# Altium project VNH2SP30 Test.PrjPcb
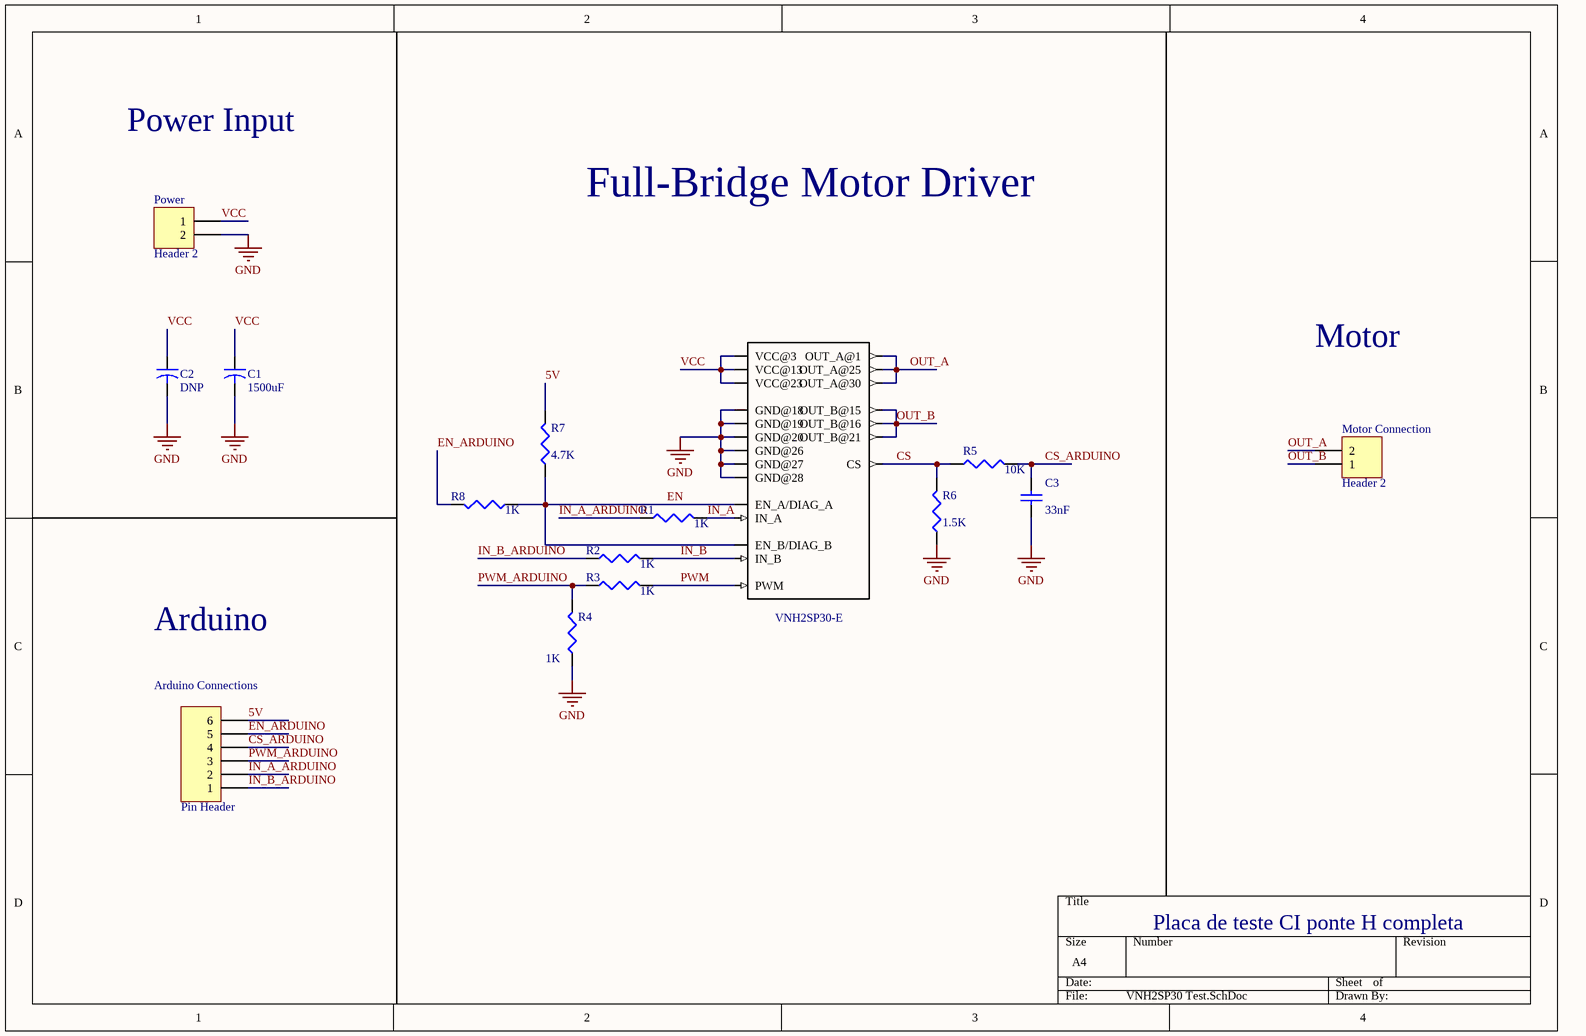
[diagram p0: VNH2SP30 Test.SchDoc]
1 sheet, 15 parts. Net scope: global (net labels, ports and power ports of the same name join across sheets).
Board file: VNH2SP30 Test.PcbDoc

## Sheet VNH2SP30 Test.SchDoc
size A4

### Parts
Arduino_Connections  Pin Header  [HDR1X6]
C1  value 1500uF  [CAPR5-4X5]  (hidden comment: Cap2)
C2  value DNP  [CAPR5-4X5]  (hidden comment: Cap2)
C3  value 33nF  [C1206]  (hidden comment: Cap Semi)
Motor_Connection  Header 2  [HDR1X2]
Motor_Driver  VNH2SP30-E  [MULTIPOWER30_VNH2SP30(Primary)]
Power  Header 2  [HDR1X2]
R1  value 1K  [J1-0603]  (hidden comment: Res3)
R2  value 1K  [J1-0603]  (hidden comment: Res3)
R3  value 1K  [J1-0603]  (hidden comment: Res3)
R4  value 1K  [J1-0603]  (hidden comment: Res3)
R5  value 10K  [J1-0603]  (hidden comment: Res3)
R6  value 1.5K  [J1-0603]  (hidden comment: Res3)
R7  value 4.7K  [J1-0603]  (hidden comment: Res3)
R8  value 1K  [J1-0603]  (hidden comment: Res3)

### Nets
GND: C1.2 C2.2 C3.1 Motor_Driver.P$18(GND@18) Motor_Driver.P$19(GND@19) Motor_Driver.P$20(GND@20) Motor_Driver.P$26(GND@26) Motor_Driver.P$27(GND@27) Motor_Driver.P$28(GND@28) Power.2 R4.1 R6.1
5V: Arduino_Connections.6 R7.2
CS: Motor_Driver.P$9(CS) R5.1 R6.2
CS_ARDUINO: Arduino_Connections.4 C3.2 R5.2
EN: Motor_Driver.P$6(EN_A/DIAG_A) Motor_Driver.P$10(EN_B/DIAG_B) R7.1 R8.1
EN_ARDUINO: Arduino_Connections.5 R8.2
IN_A: Motor_Driver.P$5(IN_A) R1.2
IN_A_ARDUINO: Arduino_Connections.2 R1.1
IN_B: Motor_Driver.P$11(IN_B) R2.2
IN_B_ARDUINO: Arduino_Connections.1 R2.1
OUT_A: Motor_Connection.2 Motor_Driver.P$1(OUT_A@1) Motor_Driver.P$25(OUT_A@25) Motor_Driver.P$30(OUT_A@30)
OUT_B: Motor_Connection.1 Motor_Driver.P$15(OUT_B@15) Motor_Driver.P$16(OUT_B@16) Motor_Driver.P$21(OUT_B@21)
PWM: Motor_Driver.P$8(PWM) R3.2
PWM_ARDUINO: Arduino_Connections.3 R3.1 R4.2
VCC: C1.1 C2.1 Motor_Driver.P$3(VCC@3) Motor_Driver.P$13(VCC@13) Motor_Driver.P$23(VCC@23) Power.1

### Notes on the sheet
- Power Input
- Full-Bridge Motor Driver
- Motor
- Arduino
- Placa de teste CI ponte H completa

### Library data of the parts
Arduino_Connections = Header 6: Header, 6-Pin; LatestRevisionDate: 17-Jul-2002; LatestRevisionNote: Re-released for DXP Platform.; Publisher: Altium Limited
C1 C2 = Cap2: Capacitor; Published: 23-Sep-2002; PackageReference: CAPR5-4X5; Publisher: Altium Limited; PackageDescription: Capacitor; 2 Leads
C3 = Cap Semi: Capacitor (Semiconductor SIM Model); Published: 8-Jun-2000; LatestRevisionDate: 29-May-2009; LatestRevisionNote: IPC-7351 Footprint Added.; PackageReference: C1206; Publisher: Altium Limited; PackageDescription: Chip Capacitor
Motor_Connection Power = Header 2: Header, 2-Pin; LatestRevisionDate: 17-Jul-2002; LatestRevisionNote: Re-released for DXP Platform.; Publisher: Altium Limited
Motor_Driver = VNH2SP30: Dip18; MF: STMicroelectronics; MP: VNH2SP30; Availability: Unavailable; SnapEDA_Link: https://www.snapeda.com/parts/VNH2SP30/STMicroelectronics/view-part/?ref=snap; Price: None; Package: DIP-18 STMicroelectronics; Value: *
R1-R8 = Res3: Resistor; Published: 8-Jun-2000; LatestRevisionDate: 29-May-2009; LatestRevisionNote: IPC-7351 Footprint Added.; PackageReference: J1-0603; Publisher: Altium Limited; PackageDescription: Chip Resistor